# EAGLE design SuperFX_revD (EAGLE 6.5.0)
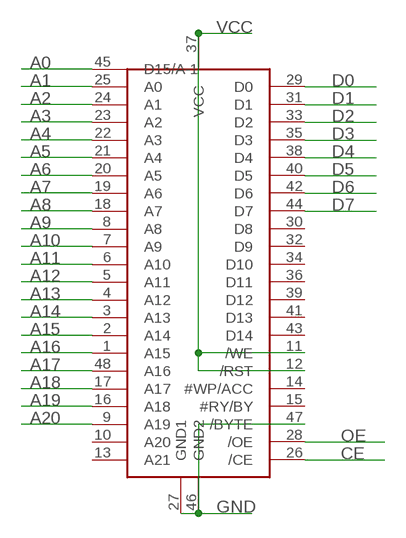
[diagram p0: schematic, sheet 1]

## Parts
U$1  29GL064TSOP48  [TSOP48]

## Nets
A0: U$1.45(D15/A-1)
A1: U$1.25(A0)
A2: U$1.24(A1)
A3: U$1.23(A2)
A4: U$1.22(A3)
A5: U$1.21(A4)
A6: U$1.20(A5)
A7: U$1.19(A6)
A8: U$1.18(A7)
A9: U$1.8(A8)
A10: U$1.7(A9)
A11: U$1.6(A10)
A12: U$1.5(A11)
A13: U$1.4(A12)
A14: U$1.3(A13)
A15: U$1.2(A14)
A16: U$1.1(A15)
A17: U$1.48(A16)
A18: U$1.17(A17)
A19: U$1.16(A18)
A20: U$1.9(A19)
CE: U$1.26(/CE)
D0: U$1.29(D0)
D1: U$1.31(D1)
D2: U$1.33(D2)
D3: U$1.35(D3)
D4: U$1.38(D4)
D5: U$1.40(D5)
D6: U$1.42(D6)
D7: U$1.44(D7)
GND: U$1.27(GND1) U$1.46(GND2) U$1.47(/BYTE)
OE: U$1.28(/OE)
VCC: U$1.11(/WE) U$1.12(/RST) U$1.37(VCC)
Unconnected: U$1.10(A20) U$1.13(A21) U$1.14(#WP/ACC) U$1.15(#RY/BY) U$1.30(D8) U$1.32(D9) U$1.34(D10) U$1.36(D11) U$1.39(D12) U$1.41(D13) U$1.43(D14)

## Library data of the parts
U$1 = 29GL064:29GL064

## Board
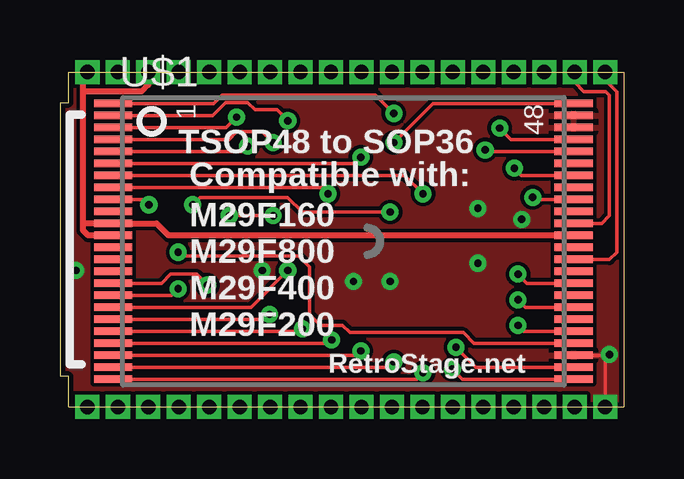
[diagram p1: board, top side]
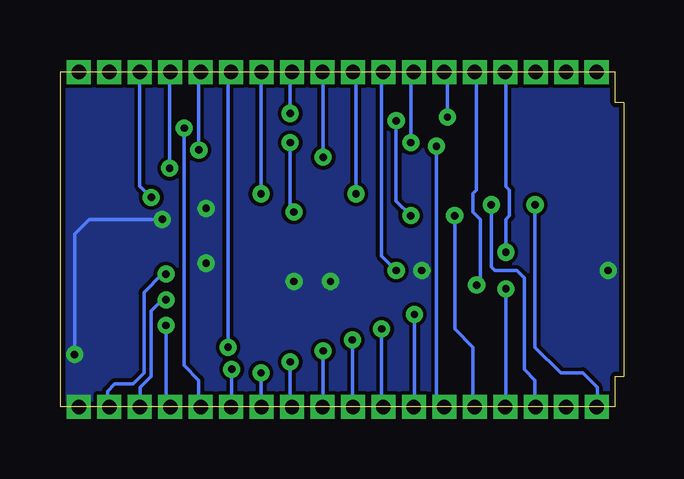
[diagram p2: board, bottom side, seen from below]

Size 23.52 x 13.97 mm. Coordinates in mm from the lower left corner, seen from the top.
Outline: 0.36,0 23.52,0 23.52,13.97 0.36,13.97 0.36,12.7 0,12.7 0,1.27 0.36,1.27 0.36,0
Copper layers (1*16): Top 0.035mm / dielectric 1.5mm / Bottom 0.035mm
Design rules "default *": minimum track width 0.13mm, minimum drill 0.4mm, track to track 6mil, track to pad 6mil, pad to pad 6mil, via to via 6mil, smd to smd 6mil, copper to edge 8mil, drill to drill 8mil, minimum pad ring 10mil, minimum via ring 8mil, stop-mask expansion 4mil, vias tented up to drill 20mil, thermal gap 10mil

### Footprints (pad centres in the part's own frame; a part is rotated, then mirrored left to right if it is on the bottom)
TSOP48 = smd 0.3 x 1.6: 1 -5.75,-9.6; 2 -5.25,-9.6; 3 -4.75,-9.6; 4 -4.25,-9.6; 5 -3.75,-9.6; 6 -3.25,-9.6; 7 -2.75,-9.6; 8 -2.25,-9.6; 9 -1.75,-9.6; 10 -1.25,-9.6; 11 -0.75,-9.6; 12 -0.25,-9.6; 13 0.25,-9.6; 14 0.75,-9.6; 15 1.25,-9.6; 16 1.75,-9.6; 17 2.25,-9.6; 18 2.75,-9.6; 19 3.25,-9.6; 20 3.75,-9.6; 21 4.25,-9.6; 22 4.75,-9.6; 23 5.25,-9.6; 24 5.75,-9.6; 25 5.75,9.6; 26 5.25,9.6; 27 4.75,9.6; 28 4.25,9.6; 29 3.75,9.6; 30 3.25,9.6; 31 2.75,9.6; 32 2.25,9.6; 33 1.75,9.6; 34 1.25,9.6; 35 0.75,9.6; 36 0.25,9.6; 37 -0.25,9.6; 38 -0.75,9.6; 39 -1.25,9.6; 40 -1.75,9.6; 41 -2.25,9.6; 42 -2.75,9.6; 43 -3.25,9.6; 44 -3.75,9.6; 45 -4.25,9.6; 46 -4.75,9.6; 47 -5.25,9.6; 48 -5.75,9.6

### Placement (x,y rotation side)
U$1  11.82,6.91 270 top

### Tracks (layer width: path | path; a pad name or v marks a point on that pad's centre or on a via)
A0  (via drill 0.3, 0.6)
  Top 0.152: U$1.45 18.81,11.16 v18.34,11.63
  Bottom 0.152: v18.34,11.63 18.34,1.73 17.73,1.12 17.73,0.08 v17.65,0
A1  (via drill 0.3, 0.6)
  Top 0.152: U$1.25 16.77,1.16 v16.36,1.57
  Bottom 0.152: v16.36,1.57 16.36,0.03 v16.38,0
A2  (via drill 0.3, 0.6)
  Top 0.152: U$1.24 14.88,1.16 v15.14,1.42
  Bottom 0.152: v15.14,1.42 15.14,0.03 v15.11,0
A3  (via drill 0.3, 0.6)
  Top 0.152: U$1.23 13.7,1.66 v13.92,1.88
  Bottom 0.152: v13.92,1.88 13.92,0.08 v13.84,0
A4  (via drill 0.3, 0.6)
  Top 0.152: U$1.22 12.37,2.16 v12.55,2.34
  Bottom 0.152: v12.55,2.34 12.55,0.03 v12.57,0
A5  (via drill 0.3, 0.6)
  Top 0.152: U$1.21 11.2,2.66 v11.33,2.79
  Bottom 0.152: v11.33,2.79 11.33,0.03 v11.3,0
A6  (via drill 0.3, 0.6)
  Top 0.152: U$1.20 10.02,3.16 v10.11,3.25
  Bottom 0.152: v10.11,3.25 10.11,0.08 v10.03,0
A7  (via drill 0.3, 0.6)
  Top 0.152: U$1.19 8.54,3.66 v8.74,3.86
  Bottom 0.152: v8.74,3.86 8.74,0.03 v8.76,0
A8  (via drill 0.3, 0.6)
  Top 0.152: U$1.18 7.97,4.16 v9.5,5.69
  Bottom 0.152: v9.5,5.69 10.11,6.3 10.11,13.89 v10.03,13.97
A9  (via drill 0.3, 0.6)
  Top 0.152: U$1.8 10.91,9.16 v11.18,8.89
  Bottom 0.152: v11.18,8.89 11.18,13.84 v11.3,13.97
A10  (via drill 0.3, 0.6)
  Top 0.152: U$1.7 14.37,9.66 v15.14,8.89
  Bottom 0.152: v15.14,8.89 15.14,13.94 v15.11,13.97
A11  (via drill 0.3, 0.6)
  Top 0.152: U$1.6 12.29,10.16 v12.55,10.41
  Bottom 0.152: v12.55,10.41 12.55,13.94 v12.57,13.97
A12  (via drill 0.3, 0.6)
  Top 0.152: U$1.5 7.61,10.66 v7.82,10.87
  Bottom 0.152: v7.82,10.87 7.82,0.33 v7.49,0
A13  (via drill 0.3, 0.6)
  Top 0.152: U$1.4 7.05,11.16 7.37,11.48 8.43,11.48 v8.89,11.02
  Bottom 0.152: v8.89,11.02 8.89,13.84 v8.76,13.97
A14  (via drill 0.3, 0.6)
  Top 0.152: U$1.3 6.94,11.66 v7.37,12.09
  Bottom 0.152: v7.37,12.09 7.37,13.84 v7.49,13.97
A15  (via drill 0.3, 0.6)
  Top 0.152: U$1.2 6.37,12.16 6.91,12.7 7.82,12.7 8.13,12.4 9.04,12.4 v9.5,11.94 | v8.89,7.98 v7.06,7.98
  Bottom 0.152: v9.5,11.94 9.5,8.59 v8.89,7.98 | v7.06,7.98 7.06,3.25 6.3,2.49 6.3,0.08 v6.22,0
A16  (via drill 0.3, 0.6)
  Top 0.152: U$1.1 6.41,12.66 6.76,13 13.16,13 v13.92,12.24
  Bottom 0.152: v13.92,12.24 13.92,13.89 v13.84,13.97
A17  (via drill 0.3, 0.6)
  Top 0.152: U$1.48 15.56,12.66 v13.92,11.02 | v13.77,8.13 10.11,8.13 9.5,8.74 5.84,8.74 v5.54,8.43
  Bottom 0.152: v13.92,11.02 13.92,8.28 v13.77,8.13 | v5.54,8.43 5.54,5.84 5.39,5.69 4.47,5.69 4.17,5.38 4.17,1.57 3.71,1.12 3.71,0.03 v3.68,0
A18  (via drill 0.3, 0.6)
  Top 0.152: U$1.17 4.66,4.66 v4.93,4.93
  Bottom 0.152: v4.93,4.93 4.93,0.03 v4.95,0
A19  (via drill 0.3, 0.6)
  Top 0.152: U$1.16 4.25,5.16 4.62,5.54 5.69,5.54 v6.15,5.08
  Bottom 0.152: v6.22,13.97 6.15,13.89 6.15,9.04 6.3,8.89 6.3,8.13 5.99,7.82 5.99,5.23 v6.15,5.08
A20  (via drill 0.3, 0.6)
  Top 0.152: U$1.9 3.48,8.66 v3.71,8.43
  Bottom 0.152: v3.71,8.43 3.71,2.49 2.64,1.42 1.73,1.42 1.12,0.81 1.12,0.02 v1.14,0
A21  (via drill 0.6)
  other vias: 2.41,0
A22  (via drill 0.6)
  other vias: 2.41,13.97
CE  (via drill 0.3, 0.6)
  Top 0.152: U$1.26 17.34,1.66 v16.51,2.49
  Bottom 0.152: v16.51,2.49 16.51,13.84 v16.38,13.97
D0  (via drill 0.3, 0.6)
  Top 0.152: U$1.29 19.34,3.16 v19.1,3.4
  Bottom 0.152: v19.1,3.4 19.1,0.18 v18.92,0
D1  (via drill 0.3, 0.6)
  Top 0.152: U$1.31 19.41,4.16 v19.1,4.47
  Bottom 0.152: v19.1,4.47 19.25,4.47 19.71,4.01 19.71,1.27 20.17,0.81 20.17,0.03 v20.19,0
D2  (via drill 0.3, 0.6)
  Top 0.152: U$1.33 19.48,5.16 v19.1,5.54
  Bottom 0.152: v19.1,5.54 19.25,5.54 20.02,4.78 20.02,1.42 20.47,0.97 21.23,0.97 21.54,0.66 21.54,0.08 v21.46,0
D3  (via drill 0.6)
  Top 0.152: v22.73,13.97 22.73,13.64 23.22,13.16 23.22,6.45 22.91,6.15 21.43,6.15 U$1.35
D4  (via drill 0.6)
  Top 0.152: v21.46,13.97 21.46,13.54 21.84,13.16 22.76,13.16 22.91,13 22.91,7.98 22.6,7.66 U$1.38
D5  (via drill 0.3, 0.6)
  Top 0.152: U$1.40 19.79,8.66 v19.71,8.74
  Bottom 0.152: v20.19,13.97 20.19,9.22 20.09,9.12 v19.71,8.74
D6  (via drill 0.3, 0.6)
  Top 0.152: U$1.42 19.25,9.66 v18.95,9.96
  Bottom 0.152: v18.95,9.96 18.95,13.94 v18.92,13.97
D7  (via drill 0.3, 0.6)
  Top 0.152: U$1.44 17.79,10.66 v17.73,10.72
  Bottom 0.152: v17.73,10.72 17.73,13.89 v17.65,13.97
GND  (via drill 0.3, 0.6)
  Top 0.152: v22.73,0 22.73,1.85 22.73,2.16 | U$1.27 22.73,2.16 | 22.73,2.16 v22.91,2.18 | v19.25,7.82 19.56,7.82
  Bottom 0.152: v22.91,2.18 22.91,7.21 22.3,7.82 v19.25,7.82
  other vias: 17.42,8.28 17.42,5.99 12.24,5.23 13.77,5.23 0.66,5.69 8.43,5.69
  pour Bottom: -0.1,13.92 23.52,13.92 23.52,0.05 -0.1,0.05
  pour Top: -0.1,13.92 23.52,13.92 23.52,0.05 -0.1,0.05
OE  (via drill 0.3, 0.6)
  Top 0.152: U$1.28 17.25,2.66 16.81,3.1 12.09,3.1 11.79,3.4 10.87,3.4 10.41,3.86 10.41,5.84 9.96,6.3 5.08,6.3 v4.93,6.45
  Bottom 0.152: v4.93,6.45 4.93,7.82 4.78,7.98 4.78,9.04 4.93,9.19 4.93,13.94 v4.95,13.97
VCC  (via drill 0.6)
  Top 0.152: 0.98,7.66 0.97,7.67
  Top 0.254: U$1.12 1.17,7.16 0.97,7.37 0.97,7.67 0.97,13.16 | 0.97,13.16 0.97,13.79 v1.14,13.97 | 0.98,7.66 U$1.11 4.02,7.66 4.52,7.16 U$1.37 | v3.68,13.97 3.68,13.44 3.4,13.16 0.97,13.16

### Text on the board
tNames: If using M29F160 for a 1MB (or less) game, / you must "double up" the ROM data to fill the chip! | TSOP48 to SOP36 | Compatible with: | M29F160 | M29F800 | M29F400 | M29F200 | RetroStage.net
tDocu: VCC / A22 / VCC / OE / A19 / A14 / A13 / A8 / A9 / A11 / A16 / A10 / CE / D7 / D6 / D5 / D4 / D3 | A20 / A21 / A17 / A18 / A15 / A12 / A7 / A6 / A5 / A4 / A3 / A2 / A1 / A0 / D0 / D1 / D2 / GND